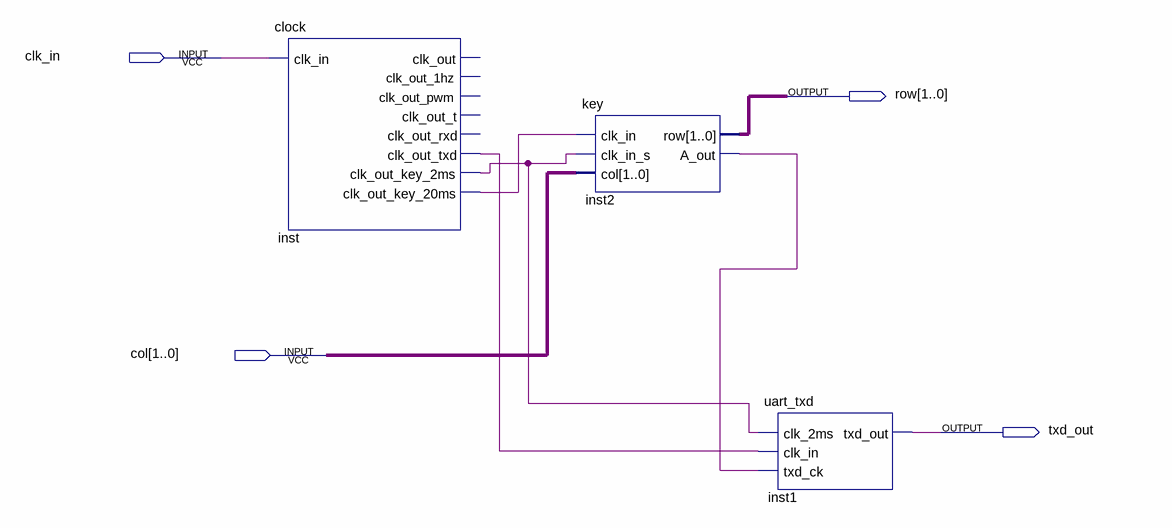
[diagram p0: schematic sheet]
// Quartus schematic uart_txd_bdf.bdf as structural Verilog: 3 symbols, 4 pins
module uart_txd_bdf (
  input  clk_in,
  input  [1:0] col,
  output [1:0] row,
  output txd_out
);

  wire inst2_a_out, inst_clk_out_key_2ms, inst_clk_out_key_20ms, inst_clk_out_txd;

  clock inst (
    .clk_in(clk_in), .clk_out_txd(inst_clk_out_txd), .clk_out_key_2ms(inst_clk_out_key_2ms),
    .clk_out_key_20ms(inst_clk_out_key_20ms));  // open: clk_out, clk_out_1hz, clk_out_pwm, clk_out_t, clk_out_rxd
  key inst2 (
    .clk_in(inst_clk_out_key_20ms), .clk_in_s(inst_clk_out_key_2ms), .col(col), .row(row), .A_out(inst2_a_out));
  uart_txd inst1 (.clk_2ms(inst_clk_out_key_2ms), .clk_in(inst_clk_out_txd), .txd_ck(inst2_a_out), .txd_out(txd_out));
endmodule
